# Altium schematic sheet Interface.SchDoc
size A
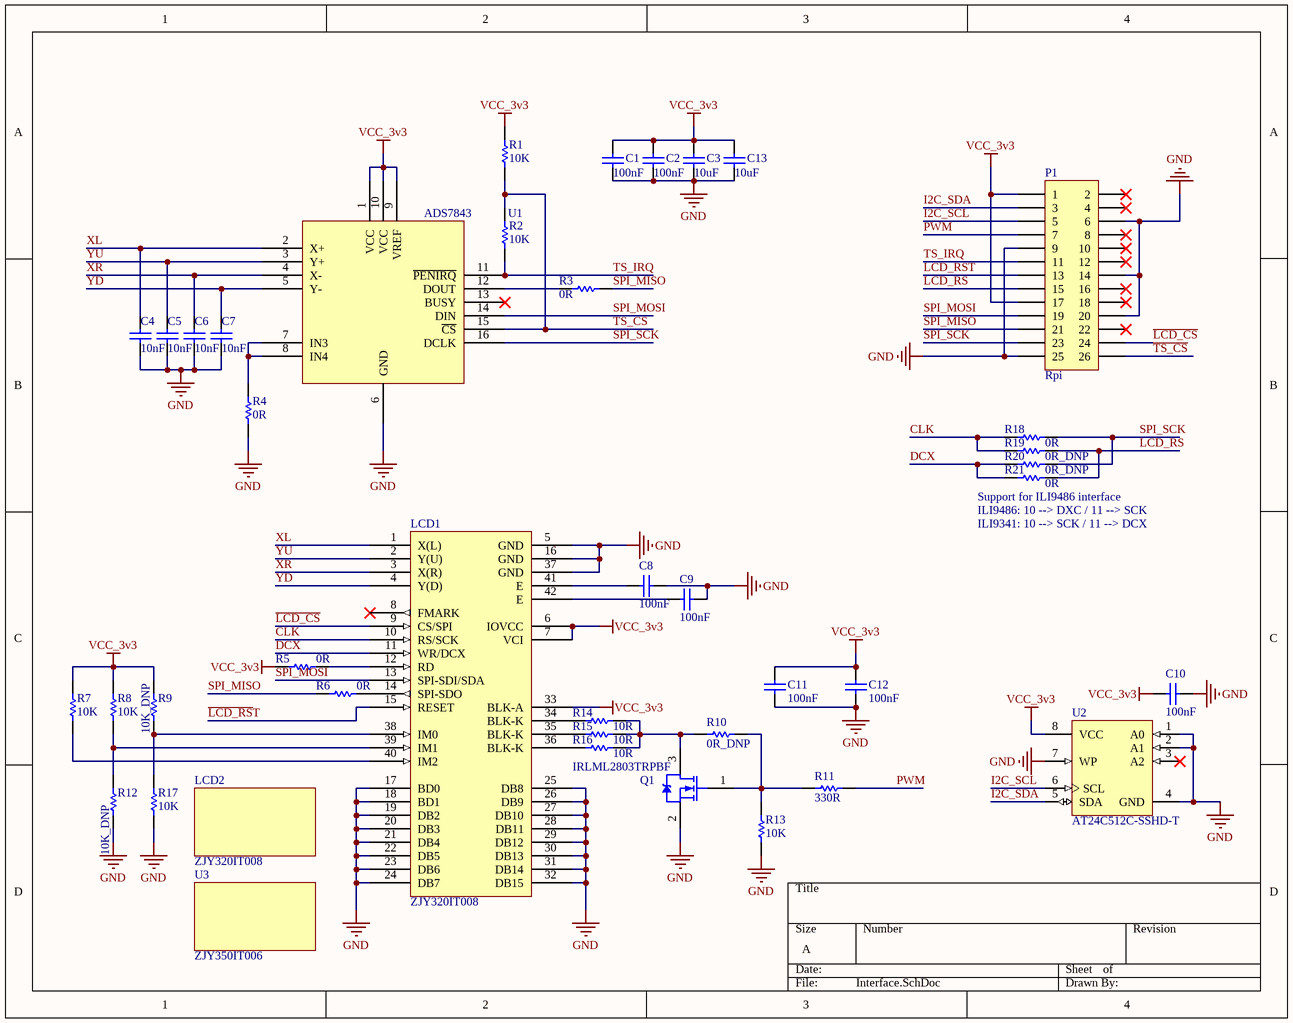
[diagram p0: Interface.SchDoc]

## Parts
C1  value 100nF  [0603PKG]  (hidden comment: Cap)
C2  value 100nF  [0603PKG]  (hidden comment: Cap)
C3  value 10uF  [0603PKG]  (hidden comment: Cap)
C4  value 10nF  [0603PKG]  (hidden comment: Cap)
C5  value 10nF  [0603PKG]  (hidden comment: Cap)
C6  value 10nF  [0603PKG]  (hidden comment: Cap)
C7  value 10nF  [0603PKG]  (hidden comment: Cap)
C8  value 100nF  [0603PKG]  (hidden comment: Cap)
C9  value 100nF  [0603PKG]  (hidden comment: Cap)
C10  value 100nF  [0603PKG]  (hidden comment: Cap)
C11  value 100nF  [0603PKG]  (hidden comment: Cap)
C12  value 100nF  [0603PKG]  (hidden comment: Cap)
C13  value 10uF  [C0805]  (hidden comment: Cap)
LCD1  ZJY320IT008  [FPC-40pin]
LCD2  ZJY320IT008  [ZJY320IT008]
P1  Rpi  [HDR2X13]
Q1  IRLML2803TRPBF  [SOT23]
R1  value 10K  [0603PKG]  (hidden comment: Res1)
R2  value 10K  [0603PKG]  (hidden comment: Res1)
R3  value 0R  [0603PKG]  (hidden comment: Res1)
R4  value 0R  [0603PKG]  (hidden comment: Res1)
R5  value 0R  [0603PKG]  (hidden comment: Res1)
R6  value 0R  [0603PKG]  (hidden comment: Res1)
R7  value 10K  [0603PKG]  (hidden comment: Res1)
R8  value 10K  [0603PKG]  (hidden comment: Res1)
R9  value 10K_DNP  [0603PKG]  (hidden comment: Res1)
R10  value 0R_DNP  [0603PKG]  (hidden comment: Res1)
R11  value 330R  [0603PKG]  (hidden comment: Res1)
R12  value 10K_DNP  [0603PKG]  (hidden comment: Res1)
R13  value 10K  [0603PKG]  (hidden comment: Res1)
R14  value 10R  [0603PKG]  (hidden comment: Res1)
R15  value 10R  [0603PKG]  (hidden comment: Res1)
R16  value 10R  [0603PKG]  (hidden comment: Res1)
R17  value 10K  [0603PKG]  (hidden comment: Res1)
R18  value 0R  [0603PKG]  (hidden comment: Res1)
R19  value 0R_DNP  [0603PKG]  (hidden comment: Res1)
R20  value 0R_DNP  [0603PKG]  (hidden comment: Res1)
R21  value 0R  [0603PKG]  (hidden comment: Res1)
U1  ADS7843  [TSSOP16]
U2  AT24C512C-SSHD-T  [8S1_N]
U3  ZJY350IT006  [ZJY350IT006]

## Nets
GND: C1.1 C2.1 C3.1 C4.1 C5.1 C6.1 C7.1 C8.1 C9.1 C10.1 C11.1 C12.2 C13.1 LCD1.5(GND) LCD1.16(GND) LCD1.17(BD0) LCD1.18(BD1) LCD1.19(DB2) LCD1.20(DB3) LCD1.21(DB4) LCD1.22(DB5) LCD1.23(DB6) LCD1.24(DB7) LCD1.25(DB8) LCD1.26(DB9) LCD1.27(DB10) LCD1.28(DB11) LCD1.29(DB12) LCD1.30(DB13) LCD1.31(DB14) LCD1.32(DB15) LCD1.37(GND) P1.6 P1.9 P1.14 P1.20 P1.25 Q1.2(S) R4.1 R12.2 R13.1 R17.2 U1.6(GND) U2.1(A0) U2.2(A1) U2.4(GND) U2.7(WP)
VCC_3v3: C1.2 C2.2 C3.2 C10.2 C11.2 C12.1 C13.2 LCD1.6(IOVCC) LCD1.7(VCI) LCD1.33(BLK-A) P1.1 P1.17 R1.1 R5.1 R7.1 R8.1 R9.1 U1.1(VCC) U1.9(VREF) U1.10(VCC) U2.8(VCC)
CLK: LCD1.10(RS/SCK) R18.1 R19.1
DCX: LCD1.11(WR/DCX) R20.1 R21.1
I2C_SCL: P1.5 U2.6(SCL)
I2C_SDA: P1.3 U2.5(SDA)
~{LCD_CS}: LCD1.9(CS/SPI) P1.24
~{LCD_RS}T: LCD1.15(RESET) P1.13
LCD_RS: P1.15 R19.2 R21.2
PWM: P1.7 R11.2
SPI_MISO: P1.21 R3.2 R6.1
SPI_MOSI: LCD1.13(SPI-SDI/SDA) P1.19 U1.14(DIN)
SPI_SCK: P1.23 R18.2 R20.2 U1.16(DCLK)
~{TS_CS}: P1.26 R1.2 R2.1 U1.15(~{CS})
TS_IRQ: P1.11 R2.2 U1.11(~{PENIRQ})
XL: C4.2 LCD1.1(X(L)) U1.2(X+)
XR: C6.2 LCD1.3(X(R)) U1.4(X-)
YD: C7.2 LCD1.4(Y(D)) U1.5(Y-)
YU: C5.2 LCD1.2(Y(U)) U1.3(Y+)
NetC8_2: C8.2 LCD1.41(E)
NetC9_2: C9.2 LCD1.42(E)
NetLCD1_12: LCD1.12(RD) R5.2
NetLCD1_14: LCD1.14(SPI-SDO) R6.2
NetLCD1_34: LCD1.34(BLK-K) R14.1
NetLCD1_35: LCD1.35(BLK-K) R15.1
NetLCD1_36: LCD1.36(BLK-K) R16.1
NetLCD1_38: LCD1.38(IM0) R9.2 R17.1
NetLCD1_39: LCD1.39(IM1) R8.2 R12.1
NetLCD1_40: LCD1.40(IM2) R7.2
NetQ1_1: Q1.1(G) R10.2 R11.1 R13.2
NetQ1_3: Q1.3(D) R10.1 R14.2 R15.2 R16.2
NetR3_1: R3.1 U1.12(DOUT)
NetR4_2: R4.2 U1.7(IN3) U1.8(IN4)

Not connected (* = marked no-connect by the designer): LCD1 8(FMARK)*; P1 2* 4* 8* 10* 12* 16* 18* 22*; U1 13(BUSY)*; U2 3(A2)*

## Notes on the sheet
- (near R21) Support for ILI9486 interface
- ILI9486: 10 --> DXC / 11 --> SCK
- ILI9341: 10 --> SCK / 11 --> DCX

## Library data of the parts
C1-C13 = Cap: Capacitor; Published: 8-Jun-2000; LatestRevisionDate: 17-Jul-2002; LatestRevisionNote: Re-released for DXP Platform.; PackageReference: RAD-0.3; Publisher: Altium Limited; PackageDescription: Radial Cap, Thru-Hole; 2 Leads; 0.3 in Pin Spacing
LCD1 = ZJY320IT008-LIB
P1 = Header 13X2: Header, 13-Pin, Dual row; LatestRevisionDate: 17-Jul-2002; LatestRevisionNote: Re-released for DXP Platform.; Publisher: Altium Limited
Q1 = NMOS-2: N-Channel Power MOSFET; Note: Pin 2 is electrically connected to pin 4.; Published: 8-Jun-2000; LatestRevisionDate: 17-Jul-2002; LatestRevisionNote: Re-released for DXP Platform.; DatasheetVersion: PD-9.814; PackageVersion: Feb-1997; PackageReference: TO-220AB; Publisher: Altium Limited; PackageDescription: TO, Thru-Hole, Vertical, Heatsink Mounted; 3 In-Line Leads; Pitch 2.54 mm; ComponentLink1Description: Manufacturer Link; ComponentLink1URL: http://www.irf.com/
R1-R21 = Res1: Resistor; Published: 8-Jun-2000; LatestRevisionDate: 17-Jul-2002; LatestRevisionNote: Re-released for DXP Platform.; PackageReference: AXIAL-0.3; Publisher: Altium Limited; PackageDescription: Axial Device, Thru-Hole; 2 Leads; 0.3 in Pin Spacing
U2 = AT24C01BN-SP25-B: 1Kbit (128 x 8), 2-wire Bus Automotive Serial EEPROM with Write Protect, 2.5V, 8-Pin SOIC, Bulk; DatasheetVersion: 8517C,  Jan-2009; PackageVersion: revC, Mar-2005; PackageReference: 8S1; PackageDescription: 8-Lead (0.150" Wide Body), Plastic Gull Wing Small Outline (JEDEC SOIC); Code_JEDEC: MS-012-AA; Code_IPC: SOIC127P600-8; ComponentLink1Description: Manufacturer URL; ComponentLink1URL: http://www.atmel.com/; ComponentLink2Description: Datasheet; ComponentLink2URL: http://www.atmel.com/dyn/resources/prod_documents/doc8517.pdf